# EAGLE design implant7 (EAGLE 7.6.0)
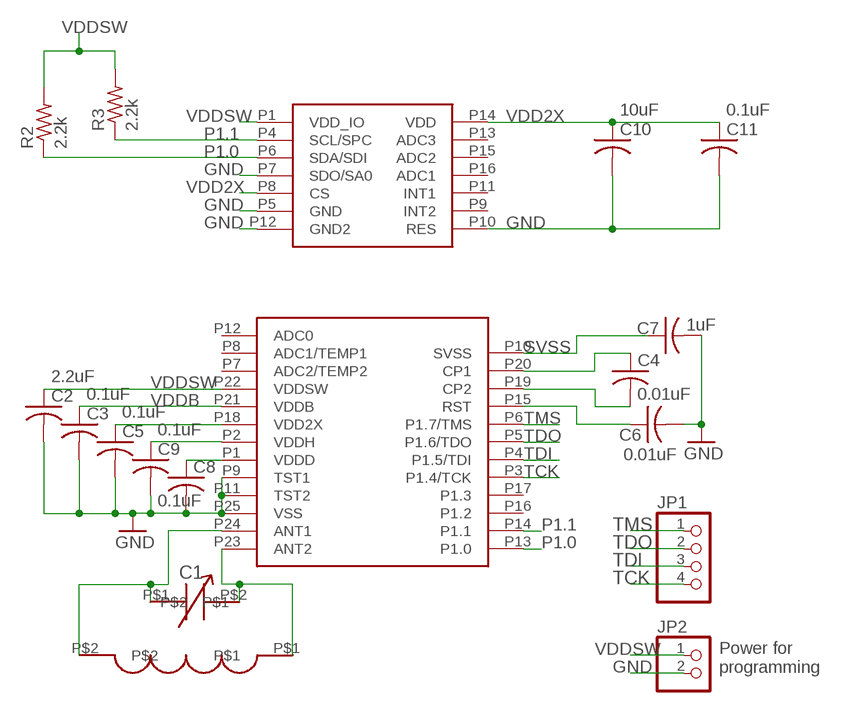
[diagram p0: schematic, sheet 1]

## Parts
C2  2.2uF  C-USC0805  [C0805]
C3  0.1uF  C-USC0805  [C0805]
C4  0.01uF  C-USC0805  [C0805]
C5  0.1uF  C-USC0805  [C0805]
C6  0.01uF  C-USC0805  [C0805]
C7  1uF  C-USC0805  [C0805]
C8  0.1uF  C-USC0805  [C0805]
C9  0.1uF  C-USC0805  [C0805]
C10  10uF  C-USC0805  [C0805]
C11  0.1uF  C-USC0805  [C0805]
JP1  PINHD-1X4  [1X04]
JP2  PINHD-1X2  [1X02]
R2  2.2k  R-US_R0805  [R0805]
R3  2.2k  R-US_R0805  [R0805]
U$1  RF430FRL152H  [VQFN]
U$2  COILCOIL3  [COIL3]
U$3  VAR_CAP  [VAR_CAP]
U$4  LIS3DH  [LGA-16]

## Nets
GND: C2.2 C3.2 C5.2 C6.2 C7.2 C8.2 C9.2 C10.2 C11.2 JP2.2 U$1.P9(TST1) U$1.P11(TST2) U$1.P25(VSS) U$4.P5(GND) U$4.P7(SDO/SA0) U$4.P10(RES) U$4.P12(GND2)
N$4: C9.1 U$1.P2(VDDH)
N$5: C8.1 U$1.P1(VDDD)
N$7: U$1.P23(ANT2) U$2.P$1 U$3.P$2
N$8: C4.1 U$1.P20(CP1)
N$9: C4.2 U$1.P19(CP2)
N$10: C6.1 U$1.P15(RST)
N$11: U$1.P24(ANT1) U$2.P$2 U$3.P$1
P1.0: R2.1 U$1.P13(P1.0) U$4.P6(SDA/SDI)
P1.1: R3.1 U$1.P14(P1.1) U$4.P4(SCL/SPC)
SVSS: C7.1 U$1.P10(SVSS)
TCK: JP1.4 U$1.P3(P1.4/TCK)
TDI: JP1.3 U$1.P4(P1.5/TDI)
TDO: JP1.2 U$1.P5(P1.6/TDO)
TMS: JP1.1 U$1.P6(P1.7/TMS)
VDD2X: C5.1 C10.1 C11.1 U$1.P18(VDD2X) U$4.P8(CS) U$4.P14(VDD)
VDDB: C3.1 U$1.P21(VDDB)
VDDSW: C2.1 JP2.1 R2.2 R3.2 U$1.P22(VDDSW) U$4.P1(VDD_IO)
Unconnected: U$1.P7(ADC2/TEMP2) U$1.P8(ADC1/TEMP1) U$1.P12(ADC0) U$1.P16(P1.2) U$1.P17(P1.3) U$4.P9(INT2) U$4.P11(INT1) U$4.P13(ADC3) U$4.P15(ADC2) U$4.P16(ADC1)

## Notes on the sheet
- C1
- Power for 
  programming

## Library data of the parts
C2-C11 = rcl:C-US: CAPACITOR, American symbol
JP1 = pinhead:PINHD-1X4: PIN HEADER
JP2 = pinhead:PINHD-1X2: PIN HEADER
R2 R3 = rcl:R-US_: RESISTOR, American symbol
U$1 = RF430:RF430FRL152H
U$2 = RF430:COIL
U$3 = RF430:VAR_CAP
U$4 = RF430:LIS3DH

## Board
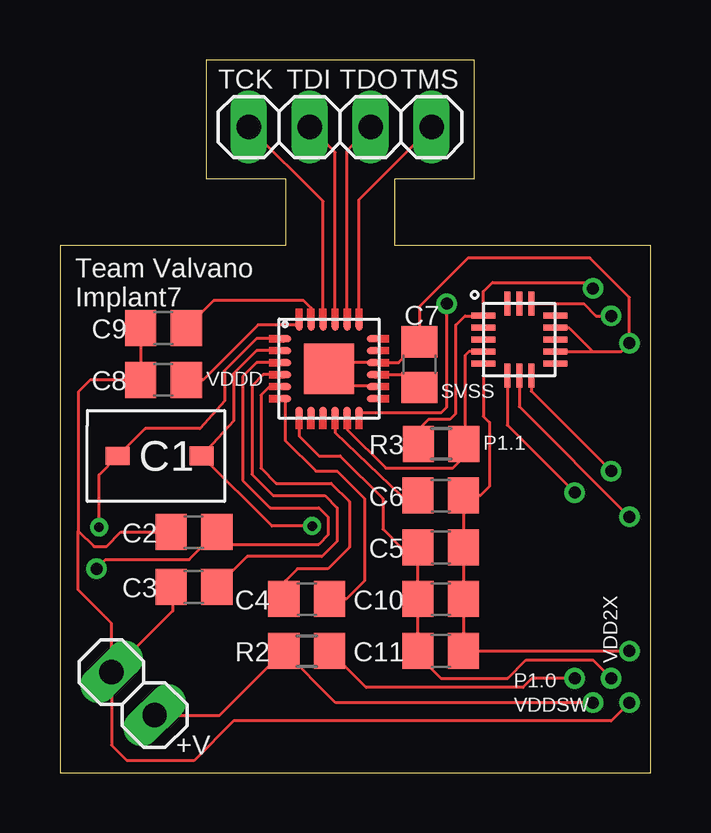
[diagram p1: board, top side]
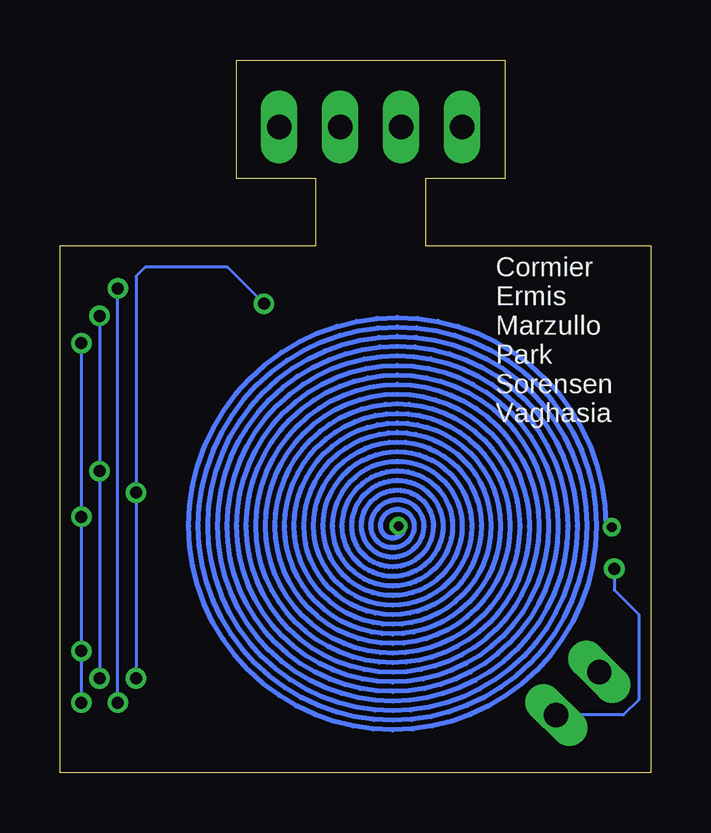
[diagram p2: board, bottom side, seen from below]

Size 24.64 x 29.72 mm. Coordinates in mm from the lower left corner, seen from the top.
Outline: 0,0 24.64,0 24.64,21.97 13.97,21.97 13.97,24.77 17.27,24.77 17.27,29.72 6.1,29.72 6.1,24.77 9.4,24.77 9.4,21.97 0,21.97 0,0
Copper layers (1*16): Top 0.0356mm / dielectric 1.5011mm / Bottom 0.0356mm
Design rules "oshpark *": minimum track width 4mil, minimum drill 12mil, track to track 6mil, track to pad 6mil, pad to pad 6mil, via to via 6mil, smd to smd 6mil, copper to edge 15mil, drill to drill 6mil, minimum pad ring 7mil, minimum via ring 7mil, stop-mask expansion 3mil, vias tented up to drill 0mil, thermal gap 10mil

### Footprints (pad centres in the part's own frame; a part is rotated, then mirrored left to right if it is on the bottom)
C0805 = smd 1.3 x 1.5: 1 -0.95,0; 2 0.95,0
1X04 = drill 1.016 long: 1 -3.81,0; 2 -1.27,0; 3 1.27,0; 4 3.81,0
1X02 = drill 1.016 long: 1 -1.27,0; 2 1.27,0
R0805 = smd 1.3 x 1.5: 1 -0.95,0; 2 0.95,0
VQFN = smd 0.3 x 0.5: P1 0.825,-0.25; P2 1.325,-0.25; P3 1.825,-0.25; P4 2.325,-0.25; P5 2.825,-0.25; P6 3.325,-0.25; P13 3.325,-3.9; P14 2.825,-3.9; P15 2.325,-3.9; P16 1.825,-3.9; P17 1.325,-3.9; P18 0.825,-3.9; P26 0.825,-0.25; P34 2.824,-3.901; P35 2.324,-3.901; P36 3.324,-3.901; P37 1.824,-3.901; P38 1.324,-3.901; P39 0.824,-3.901; P40 3.324,-3.901 | smd 0.5 x 0.3: P7 3.9,-0.825; P8 3.9,-1.325; P9 3.9,-1.825; P10 3.9,-2.325; P11 3.9,-2.825; P12 3.9,-3.325; P19 0.25,-3.325; P20 0.25,-2.825; P21 0.25,-2.325; P22 0.25,-1.825; P23 0.25,-1.325; P24 0.25,-0.825; P27 3.906,-1.325; P28 3.906,-1.825; P29 3.906,-0.825; P30 3.906,-2.325; P31 3.906,-2.825; P32 3.906,-3.325; P33 3.906,-0.825; P41 0.25,-2.825; P42 0.25,-2.325; P43 0.25,-3.325; P44 0.25,-1.825; P45 0.25,-1.325; P46 0.25,-0.825; P47 0.25,-3.325 | smd 2.1 x 2.1: P25 2.075,-2.075
COIL3 = drill 0.4 pad 0.6: P$1 0.151,-0.003; P$2 9.039,-0.051
VAR_CAP = smd 1 x 0.75: P$1 0,0 | smd 1 x 0.8: P$2 3.5,0
LGA-16 = smd 1 x 0.25: P1 0,-0.5; P2 0,-1; P3 0,-1.5; P4 0,-2; P5 0,-2.5; P9 3,-2.5; P10 3,-2; P11 3,-1.5; P12 3,-1; P13 3,-0.5 | smd 0.25 x 1: P6 1,-3; P7 1.5,-3; P8 2,-3; P14 2,0; P15 1.5,0; P16 1,0

### Placement (x,y rotation side)
C2  5.59,10.03 180 top
C3  5.59,7.75 180 top
C4  10.29,7.24 0 top
C5  15.88,9.4 0 top
C6  15.88,11.56 0 top
C7  14.99,17.02 90 top
C8  4.32,16.38 180 top
C9  4.32,18.54 180 top
C10  15.88,7.24 0 top
C11  15.88,5.08 0 top
JP1  11.68,26.92 180 top
JP2  3.05,3.3 135 top
R2  10.29,5.08 180 top
R3  15.9,13.72 180 top
U$1  9.14,18.92 0 top
U$2  10.67,10.29 0 bottom
U$3  2.41,13.21 0 top
U$4  17.65,19.56 0 top

### Tracks (layer width: path | path; a pad name or v marks a point on that pad's centre or on a via)
GND  (via drill 0.5 pad 0.3)
  Top 0.127: C9.2 C8.2 1.27,16.38 0.76,15.88 | 0.76,15.88 0.76,10.09 | 0.76,10.09 1.42,9.44 1.94,9.44 2.54,10.03 C2.2 | U$1.P11 13.11,16.1 13.08,16.13 11.3,16.13 11.3,16.8 U$1.P25 11.6,17.1 U$1.P9 14.12,17.1 C7.2 14.99,19.43 17.02,21.46 22.1,21.46 23.75,19.81 v23.75,17.91 23.4,17.56 22.22,17.56 | U$4.P10 22.22,17.56 | U$4.P12 21.22,18.56 22.22,17.56 | U$4.P7 19.15,15.26 v23.75,10.67 | v23.75,5.08 C11.2 C10.2 C5.2 C6.2 17.53,11.56 17.91,11.94 17.91,14.61 17.65,14.86 U$4.P5 | JP2.2 2.15,1.15 2.79,0.51 5.59,0.51 7.24,2.16 22.99,2.16 v23.75,2.92 | 0.76,15.88 0.77,15.88 | JP2.2 2.15,6.23 0.76,7.62 0.76,10.09 | C3.2 4.64,7.3 4.7,7.24 4.7,6.75 JP2.2
  Bottom 0.127: v23.75,17.91 v23.75,10.67 v23.75,5.08 v23.75,2.92
N$4
  Top 0.127: U$1.P2 10.47,19.38 10.16,19.68 6.41,19.68 C9.1
N$5
  Top 0.127: U$1.P1 8.26,18.67 5.97,16.38 C8.1
N$7
  Top 0.127: 5.86,13.27 U$3.P$2 | U$2.P$1 8.84,10.28 U$3.P$2 | U$1.P23 8.2,17.6 7.24,16.64 7.24,14.66 U$3.P$2
N$8
  Top 0.127: U$1.P20 8.73,16.1 8.38,15.75 8.38,12.7 9.02,12.06 11.3,12.06 12.07,11.3 12.07,9.4 11.18,8.51 9.91,8.51 9.4,8 9.4,7.3 C4.1
N$9
  Top 0.127: U$1.P19 9.39,13.85 10.67,12.57 11.56,12.57 12.7,11.43 12.7,8 11.94,7.24 C4.2
N$10
  Top 0.127: U$1.P15 11.47,14.18 14.22,11.56 C6.1
N$11
  Top 0.127: 2.37,13.27 U$3.P$1 | U$2.P$2 1.63,12.42 U$3.P$1 | U$1.P24 8.19,18.1 6.86,16.76 6.86,15.49 5.84,14.35 3.56,14.35 U$3.P$1
P1.0  (via drill 0.5 pad 0.3)
  Top 0.127: U$1.P13 15.91,15.02 16.13,15.24 v16.13,19.56 | U$4.P6 18.65,14.49 v21.46,11.68 | v21.46,3.94 19.68,3.94 19.3,3.56 12.76,3.56 R2.1
  Bottom 0.127: v21.46,3.94 v21.46,11.68 21.46,20.7 21.08,21.08 17.65,21.08 v16.13,19.56
P1.1
  Top 0.127: U$4.P4 17.05,17.56 16.89,17.4 16.89,13.76 R3.1 16.76,13.63 16.76,13.08 16.38,12.7 13.59,12.7 11.97,14.32 U$1.P14
SVSS
  Top 0.127: U$1.P10 14.46,16.6 C7.1
TCK
  Top 0.127: U$1.P3 10.97,23.83 JP1.4
TDI
  Top 0.127: U$1.P4 11.47,25.87 JP1.3
TDO
  Top 0.127: U$1.P5 11.97,25.94 JP1.2
TMS
  Top 0.127: U$1.P6 12.47,23.9 JP1.1
VDD2X  (via drill 0.5 pad 0.3)
  Top 0.127: U$4.P14 21.84,19.56 22.35,19.05 v22.99,19.05 | U$4.P8 19.65,15.91 v22.99,12.57 | v22.99,3.94 22.22,4.7 19.43,4.7 18.67,3.94 15.88,3.94 14.93,4.89 C11.1 C10.1 C5.1 14.22,9.4 13.46,10.16 13.46,11.43 11.68,13.21 10.79,13.21 9.97,14.03 U$1.P18
  Bottom 0.127: v22.99,19.05 v22.99,12.57 v22.99,3.94
VDDB
  Top 0.127: U$1.P21 8.47,16.6 8,16.13 8,12.45 8.89,11.56 11.05,11.56 11.56,11.05 11.56,9.65 10.92,9.02 7.81,9.02 C3.1
VDDSW  (via drill 0.5 pad 0.3)
  Top 0.127: v22.22,20.19 21.97,20.45 18.03,20.45 17.65,20.07 U$4.P1 17.64,19.05 16.89,19.05 16.51,18.67 16.51,14.99 16.26,14.73 15.37,14.73 14.86,14.22 14.86,13.8 R3.2 14.86,13.76 | v22.22,2.92 11.5,2.92 R2.2 6.66,2.4 JP2.1 | U$1.P22 8.21,17.1 7.62,16.51 7.62,12.19 8.76,11.05 10.79,11.05 11.18,10.67 11.18,9.91 10.79,9.53 7.11,9.53 7.11,9.65 6.73,10.03 C2.1 5.39,8.89 1.91,8.89 v1.52,8.51
  Bottom 0.127: v22.22,2.92 v22.22,20.19 | v1.52,8.51 1.52,7.62 0.51,6.6 0.51,3.05 1.14,2.41 JP2.1

### Text on the board
tPlace: TCK | TDI | TDO | TMS | Team Valvano / Implant7 | C1 | +V
tNames: VDDD | SVSS | P1.1 | VDD2X | P1.0 | VDDSW
bNames: Cormier / Ermis / Marzullo / Park / Sorensen / Vaghasia